# Altium schematic sheet IGBT_A.SchDoc: IGBT A
size A4; DrawnBy: Jarod Krane; Organization: Altium Limited; Address1: L3, 12a Rodborough Rd; Address2: Frenchs Forest; Address3: NSW; Address4: Australia 2086; Revision: 0; SheetNumber: 3; SheetTotal: 11
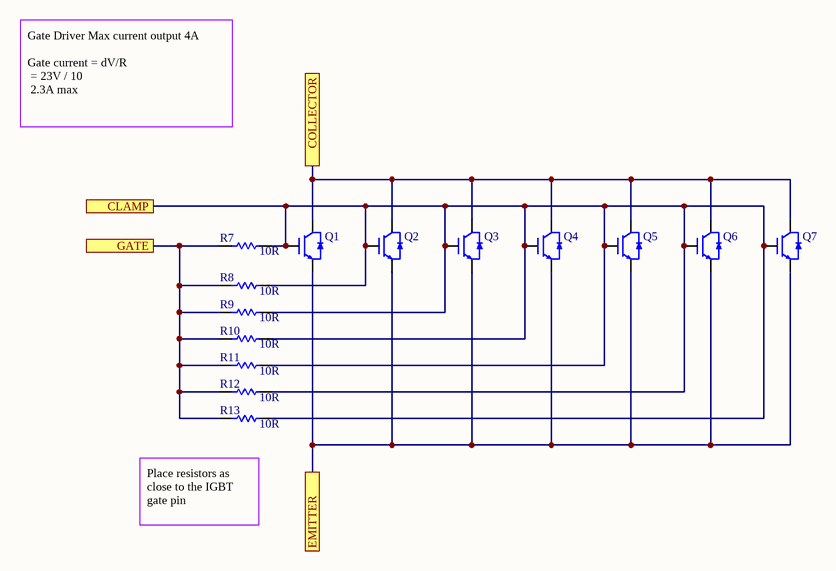
[diagram p0: IGBT_A.SchDoc]

## Parts
Q1  STGB30V60DF  [DPAK2_IGBT]  (value not drawn)
Q2  STGB30V60DF  [DPAK2_IGBT]  (value not drawn)
Q3  STGB30V60DF  [DPAK2_IGBT]  (value not drawn)
Q4  STGB30V60DF  [DPAK2_IGBT]  (value not drawn)
Q5  STGB30V60DF  [DPAK2_IGBT]  (value not drawn)
Q6  STGB30V60DF  [DPAK2_IGBT]  (value not drawn)
Q7  STGB30V60DF  [DPAK2_IGBT]  (value not drawn)
R7  10R  [RES-0603]
R8  10R  [RES-0603]
R9  10R  [RES-0603]
R10  10R  [RES-0603]
R11  10R  [RES-0603]
R12  10R  [RES-0603]
R13  10R  [RES-0603]

## Ports
CLAMP, COLLECTOR, EMITTER, GATE

## Nets
CLAMP: Q1.1 Q2.1 Q3.1 Q4.1 Q5.1 Q6.1 Q7.1 R7.2 R8.2 R9.2 R10.2 R11.2 R12.2 R13.2 ; port CLAMP
COLLECTOR: Q1.2 Q2.2 Q3.2 Q4.2 Q5.2 Q6.2 Q7.2 ; port COLLECTOR
EMITTER: Q1.3 Q2.3 Q3.3 Q4.3 Q5.3 Q6.3 Q7.3 ; port EMITTER
GATE: R7.1 R8.1 R9.1 R10.1 R11.1 R12.1 R13.1 ; port GATE

## Notes on the sheet
- Gate Driver Max current output 4A
  Gate current = dV/R
  = 23V / 10
  2.3A max
- (near R13) Place resistors as close to the IGBT gate pin
- Title
- Size:
- Date:
- A4
- Number:
- Time:
- Revision:
- Sheet
- of
- File:

## Library data of the parts
Q1-Q7 = STGB30V60DF: IGBT 600V 60A 258W D2PAK; Manufacturer: STMicroelectronics; Reverse Recovery Time: 53ns; Element Configuration: Single; Collector Emitter Saturation Voltage: 1.85V; Supplier 1: Digi-Key; Manufacturer Part Number: STGB30V60DF; Stock 1: 916; Pricing 1: 1=2.43, 10=2.015, 25=1.9496, 100=1.604, 500=1.358 (USD); Mount: Surface Mount; Case/Package: TO-263-3; Weight: 0.079014oz; Min Operating Temperature: -55°C; Max Operating Temperature: 175°C; Packaging: Tape and Reel; Collector Emitter Voltage (VCEO): 600V; Max Collector Current: 60A; Max Power Dissipation: 258W; Collector Emitter Breakdown Voltage: 600V; Max Breakdown Voltage: 600V; Package Quantity: 1000; RoHS Compliant: Yes; ComponentLink1URL: http://www.st.com/content/ccc/resource/technical/document/datasheet/14/ad/1c/bd/db/a9/4a/fc/DM00079435.pdf/files/DM00079435.pdf/jcr:content/translations/en.DM00079435.pdf?src-supplier=Digi-Key; ComponentLink1Description: http://www.st.com/content/ccc/resource/technical/document/datasheet/14/ad/1c/bd/db/a9/4a/fc/DM00079435.pdf/files/DM00079435.pdf/jcr:content/translations/en.DM00079435.pdf?src-supplier=Digi-Key; ComponentLink2URL: http://www.mouser.com/ds/2/389/stgb30v60df-956007.pdf?src-supplier=Mouser; ComponentLink2Description: http://www.mouser.com/ds/2/389/stgb30v60df-956007.pdf?src-supplier=Mouser; ComponentLink3URL: http://www.st.com/st-web-ui/static/active/en/resource/technical/document/datasheet/DM00079435.pdf?src-supplier=Avnet; ComponentLink3Description: http://www.st.com/st-web-ui/static/active/en/resource/technical/document/datasheet/DM00079435.pdf?src-supplier=Avnet; ComponentLink4URL: http://components.arrow.com/part/dataview/0323_06933392?src-supplier=Arrow+Europe; ComponentLink4Description: http://components.arrow.com/part/dataview/0323_06933392?src-supplier=Arrow+Europe; Supplier Part Number 1: 497-15120-6-ND
R7-R13 = 0603-10R: RES SMD 10 OHM 1% 1/10W 0603; Manufacturer: Yageo; Manufacturer Part Number: RC0603FR-0710RL; Voltage Rating (DC): 50V; Temperature Coefficient: 200ppm/°C; Power Rating: 100mW; Supplier 1: Digi-Key; Stock 1: 11151092; Pricing 1: 1=0.1, 10=0.046, 100=0.0187, 1000=0.0084, 2500=0.00729 (USD); Case/Package: 0603; Number of Pins: 2; Case Code (Imperial): 0603; Case Code (Metric): 1608; Contact Plating: Tin,Matte; Min Operating Temperature: -55°C; Max Operating Temperature: 155°C; Packaging: Tape and Reel; Resistance: 10R; Tolerance: 1%; Composition: Thick Film; Voltage Rating: 50V; Termination: SMD/SMT; Military Standard: Not; Length: 1.6mm; Height: 0.45mm; Width: 0.8mm; Depth: 0.8mm; Radiation Hardening: No; REACH SVHC: No SVHC; Lead Free: Lead Free; ComponentLink1URL: http://www.farnell.com/datasheets/1868787.pdf?src-supplier=Element14; ComponentLink1Description: http://www.farnell.com/datasheets/1868787.pdf?src-supplier=Element14; ComponentLink2URL: http://www.yageo.com/documents/recent/PYu-RC0603_51_RoHS_L_4.pdf?src-supplier=Avnet; ComponentLink2Description: http://www.yageo.com/documents/recent/PYu-RC0603_51_RoHS_L_4.pdf?src-supplier=Avnet; ComponentLink3URL: http://documents.rs-components.com/techlib://itc_doclist_GB.htm?stockno=5048984&src-supplier=RSComponents; ComponentLink3Description: http://documents.rs-components.com/techlib://itc_doclist_GB.htm?stockno=5048984&src-supplier=RSComponents; ComponentLink4URL: http://www.yageo.com/documents/recent/PYu-RC0603_51_RoHS_L_4.pdf?src-supplier=Avnet+Europe; ComponentLink4Description: http://www.yageo.com/documents/recent/PYu-RC0603_51_RoHS_L_4.pdf?src-supplier=Avnet+Europe; Supplier Part Number 1: 311-10.0HRDKR-ND